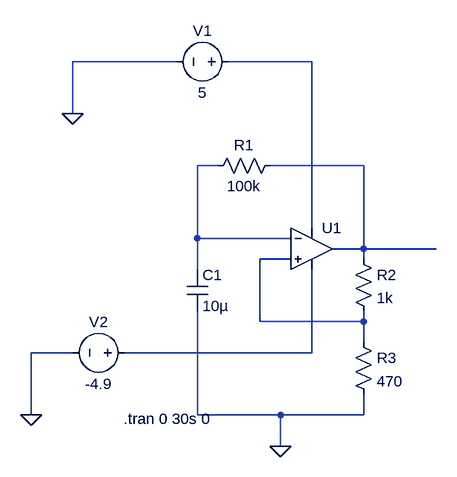
[diagram p0: schematic SchmittT-Oscillator.asc]
SchmittT-Oscillator.asc, the LTspice schematic file:
Version 4
SHEET 1 880 680
WIRE 16 -80 -144 -80
WIRE 224 -80 96 -80
WIRE -144 0 -144 -80
WIRE 80 80 48 80
WIRE 304 80 160 80
WIRE 224 176 224 -80
WIRE 48 192 48 80
WIRE 192 192 48 192
WIRE 304 208 304 80
WIRE 304 208 256 208
WIRE 416 208 304 208
WIRE 192 224 144 224
WIRE 304 224 304 208
WIRE 48 240 48 192
WIRE 144 320 144 224
WIRE 304 320 304 304
WIRE 304 320 144 320
WIRE 304 352 304 320
WIRE -144 368 -208 368
WIRE 224 368 224 240
WIRE 224 368 -64 368
WIRE -208 464 -208 368
WIRE 48 464 48 304
WIRE 176 464 48 464
WIRE 304 464 304 432
WIRE 304 464 176 464
WIRE 176 512 176 464
FLAG -144 0 0
FLAG -208 464 0
FLAG 176 512 0
SYMBOL Opamps\\UniversalOpamp2 224 208 R0
SYMATTR InstName U1
SYMBOL voltage 112 -80 R90
WINDOW 0 -32 56 VBottom 2
WINDOW 3 32 56 VTop 2
WINDOW 123 0 0 Left 0
WINDOW 39 0 0 Left 0
SYMATTR InstName V1
SYMATTR Value 5
SYMBOL res 176 64 R90
WINDOW 0 0 56 VBottom 2
WINDOW 3 32 56 VTop 2
SYMATTR InstName R1
SYMATTR Value 100k
SYMBOL cap 32 240 R0
SYMATTR InstName C1
SYMATTR Value 10µ
SYMBOL res 288 208 R0
SYMATTR InstName R2
SYMATTR Value 1k
SYMBOL res 288 336 R0
SYMATTR InstName R3
SYMATTR Value 470
SYMBOL voltage -48 368 R90
WINDOW 0 -32 56 VBottom 2
WINDOW 3 32 56 VTop 2
WINDOW 123 0 0 Left 0
WINDOW 39 0 0 Left 0
SYMATTR InstName V2
SYMATTR Value -4.9
TEXT -66 470 Left 2 !.tran 0 30s 0

The netlist it stands for:
* SchmittT-Oscillator.asc
XU1 N004 N002 N001 N005 N003 level.2 Avol=1Meg GBW=10Meg Slew=10Meg ilimit=25m rail=0 Vos=0 phimargin=45 en=0 enk=0 in=0 ink=0 Rin=500Meg  ; pins IN+ IN- V+ V- OUT
V1 N001 0 5
R1 N003 N002 100k
C1 N002 0 10µ
R2 N003 N004 1k
R3 N004 0 470
V2 N005 0 -4.9
.tran 0 30s 0
.lib UniversalOpamps2.sub
.backanno
.end